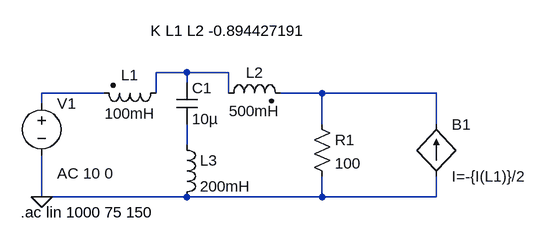
[diagram p0: schematic Part2.asc]
Part2.asc, the LTspice schematic file:
Version 4
SHEET 1 880 680
WIRE 288 96 240 96
WIRE 352 96 288 96
WIRE 288 112 288 96
WIRE 160 128 64 128
WIRE 240 128 240 96
WIRE 352 128 352 96
WIRE 496 128 432 128
WIRE 672 128 496 128
WIRE 64 144 64 128
WIRE 496 176 496 128
WIRE 672 176 672 128
WIRE 288 208 288 176
WIRE 64 288 64 224
WIRE 288 288 64 288
WIRE 496 288 496 256
WIRE 496 288 288 288
WIRE 672 288 672 256
WIRE 672 288 496 288
FLAG 64 288 0
SYMBOL voltage 64 128 R0
WINDOW 123 24 124 Left 2
WINDOW 39 0 0 Left 0
SYMATTR Value2 AC 10 0
SYMATTR InstName V1
SYMATTR Value ""
SYMBOL ind2 256 112 R90
WINDOW 0 4 56 VBottom 2
WINDOW 3 32 56 VTop 2
SYMATTR InstName L1
SYMATTR Value 100mH
SYMBOL ind2 336 144 R270
WINDOW 0 32 56 VTop 2
WINDOW 3 4 56 VBottom 2
SYMATTR InstName L2
SYMATTR Value 500mH
SYMBOL ind 272 192 R0
SYMATTR InstName L3
SYMATTR Value 200mH
SYMBOL cap 272 112 R0
SYMATTR InstName C1
SYMATTR Value 10µ
SYMBOL res 480 160 R0
SYMATTR InstName R1
SYMATTR Value 100
SYMBOL bi2 672 176 R0
SYMATTR InstName B1
SYMATTR Value I=-{I(L1)}/2
TEXT 232 32 Left 2 !K L1 L2 -0.894427191
TEXT 32 312 Left 2 !.ac lin 1000 75 150

The netlist it stands for:
* Part2.asc
V1 N002 0 AC 10 0
L1 N001 N002 100mH
L2 N001 N003 500mH
L3 N004 0 200mH
C1 N001 N004 10µ
R1 N003 0 100
B1 0 N003 I=-{I(L1)}/2
K L1 L2 -0.894427191
.ac lin 1000 75 150
.backanno
.end